# Altium project MotorPID.PrjPcb
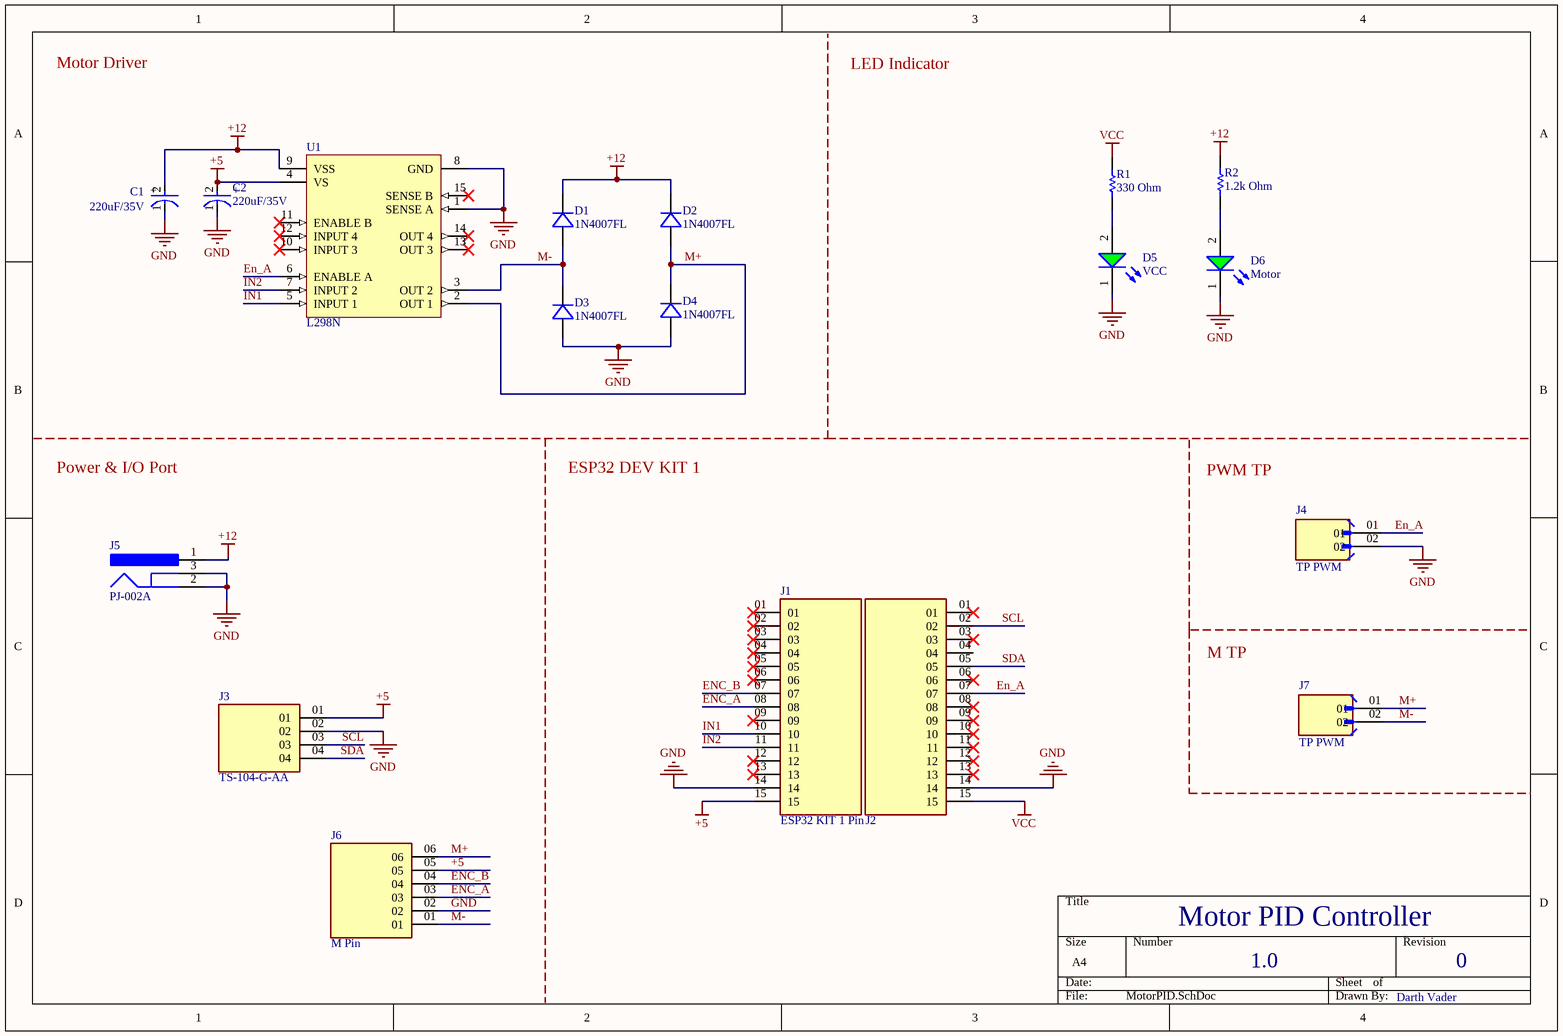
[diagram p0: MotorPID.SchDoc]
1 sheet, 18 parts. Net scope: global (net labels, ports and power ports of the same name join across sheets).
Board file: MotorPID.PcbDoc

## Sheet MotorPID.SchDoc
size A4; SheetNumber: 1; SheetTotal: 1

### Parts
C1  220uF/35V  [FP-FKF-MFG]
C2  220uF/35V  [FP-FKF-MFG]
D1  1N4007FL  [CR_SOD-123FL_SME-L]
D2  1N4007FL  [CR_SOD-123FL_SME-L]
D3  1N4007FL  [CR_SOD-123FL_SME-L]
D4  1N4007FL  [CR_SOD-123FL_SME-L]
D5  VCC  [WL-SMCW_1206_150120xx75000]
D6  Motor  [WL-SMCW_1206_150120xx75000]
J1  ESP32 KIT 1 Pin  [SAMTEC_TS-115-T-A]
J2  TS-115-T-A  [SAMTEC_TS-115-T-A]  (value not drawn)
J3  TS-104-G-AA  [SAMTEC_TS-104-G-AA]
J4  TP PWM  [SULLINS_GRPB021VWVN-RC]
J5  PJ-002A  [CUI-PJ-002A_V]
J6  M Pin  [SAMTEC_TS-106-G-AA]
J7  TP PWM  [SULLINS_GRPB021VWVN-RC]
R1  330 Ohm  [RESC3216X70X50LL05T20]
R2  1.2k Ohm  [RESC3216X70X50LL05T20]
U1  L298N  [STM-FM-15]

### Nets
+5: C2.2(A) J1.15 J3.01 J6.05 U1.4(VS)
+12: C1.2(A) D1.1(CATHODE) D2.1(CATHODE) J5.1 R2.2 U1.9(VSS)
GND: C1.1(C) C2.1(C) D3.2(ANODE) D4.2(ANODE) D5.1(K) D6.1(K) J1.14 J2.14 J3.02 J4.02 J5.2 J5.3 J6.02 U1.1(SENSE_A) U1.8(GND)
VCC: J2.15 R1.2
En_A: J2.07 J4.01 U1.6(ENABLE_A)
ENC_A: J1.08 J6.03
ENC_B: J1.07 J6.04
IN1: J1.10 U1.5(INPUT_1)
IN2: J1.11 U1.7(INPUT_2)
M+: D2.2(ANODE) D4.1(CATHODE) J6.06 J7.01 U1.2(OUT_1)
M-: D1.2(ANODE) D3.1(CATHODE) J6.01 J7.02 U1.3(OUT_2)
SCL: J2.02 J3.03
SDA: J2.05 J3.04
NetD5_2: D5.2(A) R1.1
NetD6_2: D6.2(A) R2.1

Not connected (* = marked no-connect by the designer): J1 01* 02* 03* 04* 05* 06* 09* 12* 13*; J2 01* 03* 04 06* 08* 09* 10* 11* 12* 13*; U1 10(INPUT_3)* 11(ENABLE_B)* 12(INPUT_4)* 13(OUT_3)* 14(OUT_4)* 15(SENSE_B)*

### Notes on the sheet
- Motor Driver
- LED Indicator
- Power & I/O Port
- ESP32 DEV KIT 1
- PWM TP
- M TP
- Motor PID Controller
- 1.0
- 0
- Darth Vader
- (in symbol CMP-05427-000085-1) +

### Library data of the parts
C1 C2 = CMP-05427-000085-1: CAP ALUM 220UF 20% 35V SMD; Material: Aluminium; Ripple Current (AC): 600mA; Leakage Current: 3uA; Impedance: 160mR; Life (Hours): 2000Hour; Construction: Cylindrical; Voltage Rating: 35V; Voltage: 35V; Size: 10.2mm; Width: 10mm; Capacitance: 220uF; Height: 10.2mm; Package Quantity: 1; Tolerance: 20%; Dielectric Material: Aluminium; Contact Plating: Tin; Case/Package: Radial; Lead Free: Lead Free; RoHS Compliant: Yes; Height - Seated (Max): 0.402inch; Length: 10.2mm; Radiation Hardening: No; Packaging: Tape and Reel; Mount: Surface Mount; Max Operating Temperature: 105°C; Number of Pins: 2; REACH SVHC: No SVHC; Ripple Current: 600mA; Diameter: 8mm; Termination: SMD/SMT; ESR (Equivalent Series Resistance): 160mR; Voltage Rating (DC): 35V; Min Operating Temperature: -55°C; Series: FK
D1-D4 = 1N4007FL: No Description Available; Mfr_Name: SMC Diode Solutions
D5 D6 = CMP-1426-00014-4: WL-SMCW SMT Mono-Color Chip LED Waterclear 1206; Dominant Wavelength: 525nm; Reverse Voltage: 5V; Max Junction Temperature (Tj): 95°C; Lens Style: Clear, Rectangular; Forward Voltage: 3.2V; Power Dissipation: 105mW; Peak Wavelength: 515nm; Test Current: 20mA; Color: Green; Forward Current: 100mA; Luminous Intensity: 450mcd; Viewing Angle: 140°; Case Code (Imperial): 1206; REACH SVHC: Unknown; Packaging: Tape and Reel; Max Operating Temperature: 85°C; Case/Package: 1206; Height: 680µm; Length: 3.2mm; Mount: Surface Mount; Min Operating Temperature: -40°C; Width: 1.6mm; Case Code (Metric): 3216; Max Reverse Voltage (DC): 5V; RoHS: Compliant; Wavelength: 525nm
J1 J2 = TS-115-T-A: MF: Samtec Inc.; Package: None; Price: None; Value: *; MP: TS-115-T-A; Availability: Unavailable
J3 = TS-104-G-AA: MF: Samtec Inc.; Price: None; Package: None; Availability: Unavailable; Value: *; MP: TS-104-G-AA
J4 J7 = GRPB021VWVN-RC: Package: None; MP: GRPB021VWVN-RC; Availability: Unavailable; Price: None; Value: *
J5 = CMP-2000-06895-2: Through Hole Right Angle DC Power Jack, 2.5 A, 2 mm Center Pin, 3 Position, -25 to 85 degC, RoHS, Bulk; Manufacturer: CUIInc.; Brand: CUI; Inside Contact Diameter: 2mm; Voltage Rating: 24V; Outside Contact Diameter: 6.5mm; Current Rating: 2.5A; Insulation Resistance: 50MOhms; Contact Gender: Male; Connector Type: DCPowerJack; Datasheet Version: Rev. 1.03, 04/2016; Housing Material: PolybutyleneTerephthalate(PBT); Operating Temperature Range: -25Cto+85C; Termination Style: ThroughHole; Product Category: DCPowerConnectors; Mounting Technology: ThroughHole; Mounting Style: ThroughHole; Factory Pack Quantity: 500; Contact Plating: Nickel; Package Reference: PJ-002A; Mounting Angle: Right; Package Description: 3-Pin Through Hole Device, Body 14.4 x 9 mm, Height 11 mm; Flammability Rating: UL94V-0; Manufacturer URL: http://www.cui.com/; Product: Jacks; Contact Material: Copper; Datasheet URL: http://www.cui.com/product/resource/pj-002a.pdf; RoHS: True
J6 = TS-106-G-AA: Conn Unshrouded Header HDR 6 POS 2.54mm Solder ST Thru-Hole Tube; MF: Samtec; Package: None; Check_prices: https://www.snapeda.com/parts/TS-106-G-AA/Samtec/view-part/?ref=eda; Value: *; Price: None; MP: TS-106-G-AA; Purchase-URL: https://pricing.snapeda.com/search/part/TS-106-G-AA/?ref=eda; SnapEDA_Link: https://www.snapeda.com/parts/TS-106-G-AA/Samtec/view-part/?ref=snap; Availability: In Stock
R1 R2 = CMP-2003-00017-1: Manufacturer: Panasonic; Part Number: ERJ-8ENF1001V
U1 = CMP-2000-06526-1: Dual Full-Bridge Driver, 4.8 to 46 V, -40 to 150 degC, 15-Pin FM (MW 15L), RoHS, Tube; Manufacturer: STMicroelectronics; PartNumber: L298; Output Current: 2A; Supply Voltage Max: 7V; Driver Case Style: Multiwatt; Supply Voltage Min: 4.5V; No. of Pins: 15Pins; SVHC: NoSVHC(17-Dec-2015); Output Voltage: 46V; No. of Outputs: 4Outputs; Motor Type: FullBridge; MSL: -; Package Description: 15-Pin Flange Mount, Body 5 x 19.6 mm, Pitch 1.27 mm; Datasheet Version: 01/2000; Package Reference: FM-15; Mounting Technology: ThroughHole; Packaging: Each; Automotive Qualification Standard: -; Product Range: -; Datasheet URL: https://datasheet.ciiva.com/15109/getdatasheetpartid-50682-15109332.pdf; Operating Temperature Max: 130°C; Operating Temperature Min: -25°C; Manufacturer URL: http://www.st.com/